# EAGLE design firefly (EAGLE 6.2)
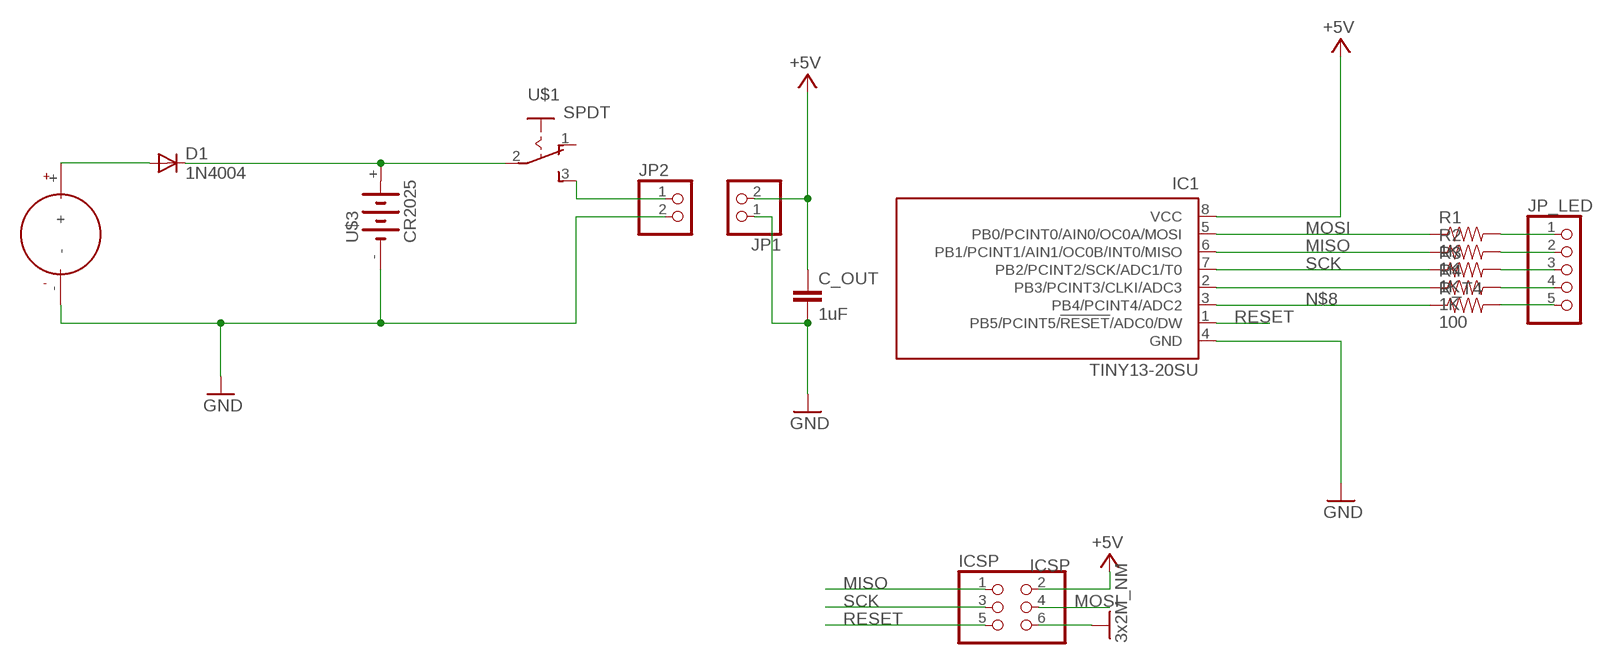
[diagram p0: schematic, sheet 1]

## Parts
C_OUT  1uF  CAP0805  [0805]
D1  1N4004  [DO41-10]
IC1  TINY13-20SU  [8S2]
ICSP  ICSP  PINHD-2X3  [2X03]
JP1  PINHD-1X2  [1X02]
JP2  PINHD-1X2  [1X02]
JP_LED  PINHD-1X5  [1X05]
R1  1K  RESISTOR  [0805]
R2  1K  RESISTOR  [0805]
R3  1K  RESISTOR  [0805]
R4  1K  RESISTOR  [0805]
R_T4  100  RESISTOR  [0805]
U$1  SPDT  [SPDT]
U$3  CR2025  [CR2025]
U$4  PANEL_60_60  [PANEL_60_60]

## Nets
+5V [usbvcc]: C_OUT.1 IC1.8(VCC) ICSP.2 JP1.2
GND: C_OUT.2 IC1.4(GND) ICSP.6 JP1.1 JP2.2 U$3.- U$4.- ; supply symbol labelled 3x2M_NM
MISO: IC1.6(PB1/PCINT1/AIN1/OC0B/INT0/MISO) ICSP.1 R2.1
MOSI: IC1.5(PB0/PCINT0/AIN0/OC0A/MOSI) ICSP.4 R1.1
N$1: JP_LED.1 R1.2
N$2: JP_LED.5 R_T4.2
N$3: D1.A U$4.+
N$4: D1.C U$1.2(P) U$3.+
N$5: JP_LED.2 R2.2
N$6: IC1.2(PB3/PCINT3/CLKI/ADC3) R4.1
N$7: JP_LED.3 R3.2
N$8: IC1.3(PB4/PCINT4/ADC2) R_T4.1
N$9: JP2.1 U$1.3(S)
N$10: JP_LED.4 R4.2
RESET: IC1.1(PB5/PCINT5/!RESET!/ADC0/DW) ICSP.5
SCK: IC1.7(PB2/PCINT2/SCK/ADC1/T0) ICSP.3 R3.1
Unconnected: U$1.1(O)

## Library data of the parts
C_OUT = SparkFun:CAP: Capacitor Standard 0603 ceramic capacitor, and 0.1" leaded capacitor.
D1 = diode:1N4004: DIODE general purpose rectifier, 1 A
IC1 = atmel:TINY13: 8-bit AVR Microcontroller with 1K Bytes In-System Programmable Flash Source: http://www.atmel.com/dyn/resources/prod_documents/2535S.pdf; MPN: ATTINY13-20SU; OC_FARNELL: 9171568; OC_NEWARK: 96K6522
ICSP = SmartPrj:PINHD-2X3: PIN HEADER
JP1 JP2 = pinhead:PINHD-1X2: PIN HEADER
JP_LED = pinhead:PINHD-1X5: PIN HEADER
R1-R4 R_T4 = SparkFun:RESISTOR: Resistor Basic schematic elements and footprints for 0603, 1206, and PTH 1/10th watt (small) resistors.
U$1 = SPDT switch:SPDT: http://ro.farnell.com/jsp/search/productdetail.jsp?SKU=1201431
U$3 = cr2025:CR2025
U$4 = PANEL_60_60:PANEL_60_60

## Net classes
2 gnd: width 0.254 mm, drill 0.61 mm, clearance 0.254 mm
3 usbvcc: width 0.254 mm, drill 0.61 mm, clearance 0.254 mm

## Board
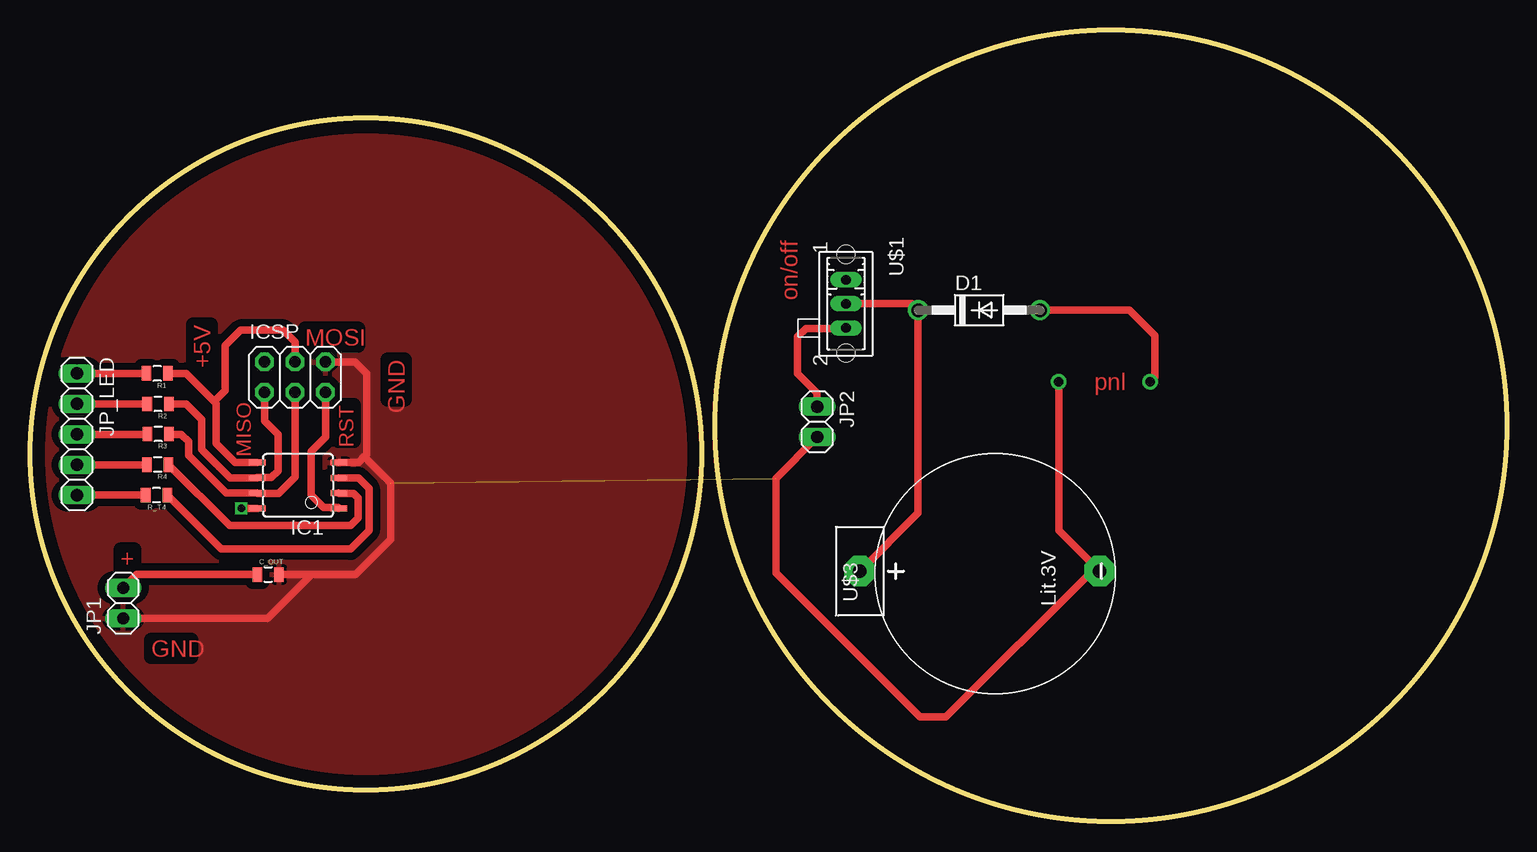
[diagram p1: board, top side]
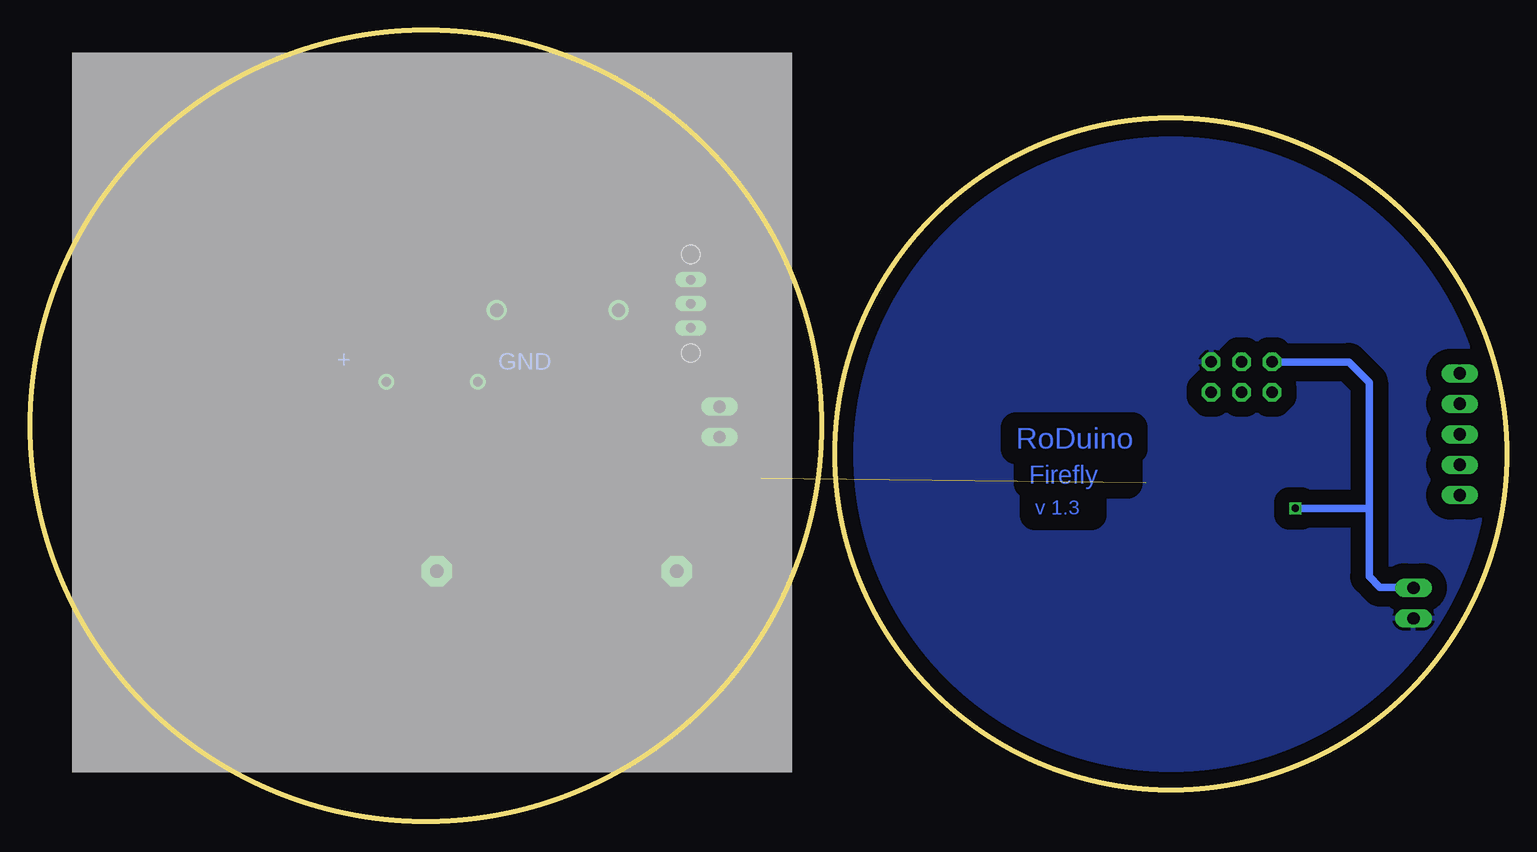
[diagram p2: board, bottom side, seen from below]

Size 123.1 x 66 mm. Coordinates in mm from the lower left corner, seen from the top.
Outline: circle at 28,30.65 radius 28
Outline: circle at 90.1,33 radius 33
Copper layers (1*16): Top 0.035mm / dielectric 1.5mm / Bottom 0.035mm
Design rules: minimum track width 10mil, minimum drill 24mil, track to track 8mil, track to pad 8mil, pad to pad 8mil, via to via 8mil, smd to smd 8mil, copper to edge 40mil, drill to drill 8mil, minimum pad ring 10mil, minimum via ring 8mil, stop-mask expansion 4mil, vias tented up to drill 0mil, thermal gap 10mil

### Footprints (pad centres in the part's own frame; a part is rotated, then mirrored left to right if it is on the bottom)
0805 = smd 0.8 x 1.2: 1 -0.9,0; 2 0.9,0
DO41-10 = drill 1.118: A 5.08,0; C -5.08,0
8S2 = smd 0.5 x 1.4: 1 -1.905,-3.404; 2 -0.645,-3.404; 3 0.625,-3.404; 4 1.895,-3.404; 5 1.905,3.404; 6 0.635,3.404; 7 -0.635,3.404; 8 -1.905,3.404
2X03 = drill 0.95 pad 1.55 octagon: 1 -2.54,-1.27; 2 -2.54,1.27; 3 0,-1.27; 4 0,1.27; 5 2.54,-1.27; 6 2.54,1.27
1X02 = drill 1.016 long: 1 -1.27,0; 2 1.27,0
1X05 = drill 1.016 long: 1 -5.08,0; 2 -2.54,0; 3 0,0; 4 2.54,0; 5 5.08,0
SPDT = drill 0.8 long: 1 -2.007,0; 2 0,0; 3 2.007,0 | hole 1.5: -4.115,0; 4.115,0
CR2025 = drill 1.118 pad 2.54 octagon: + 0,10; - 0,-10
PANEL_60_60 = drill 0.8: + -3.81,2.54; - 3.81,2.54

### Placement (x,y rotation side)
C_OUT  19.86,20.6 0 top
D1  79.12,42.64 0 top
IC1  22.34,28.03 90 top
ICSP  22.09,37.05 0 top
JP1  7.77,18.22 90 top
JP2  65.62,33.32 270 top
JP_LED  3.92,32.29 270 top
R1  10.61,37.36 180 top
R2  10.67,34.81 180 top
R3  10.68,32.31 180 top
R4  10.64,29.76 180 top
R_T4  10.55,27.21 180 top
U$1  68.02,43.17 270 top
U$3  79.17,20.87 90 top
U$4  89.57,34.12 0 bottom

### Tracks (layer width: path | path; a pad name or v marks a point on that pad's centre or on a via)
+5V  (via drill 0.6)
  Top 0.61: C_OUT.1 8.88,20.6 JP1.2 | IC1.8 v17.62,26.12
  Bottom 0.61: ICSP.2 13.17,38.32 11.47,36.62 11.47,25.97 | 11.47,25.97 11.47,20.42 10.57,19.52 7.8,19.52 JP1.2 | v17.62,26.12 11.62,26.12 11.47,25.97
GND  (1 unrouted)
  Top 0.61: IC1.4 27.38,29.93 27.87,30.42 | 27.87,30.42 28.07,30.62 28.07,37.37 27.12,38.32 ICSP.6 | C_OUT.2 23.47,20.6 | 23.47,20.6 27.15,20.6 30.07,23.52 30.07,28.22 27.87,30.42 | 23.47,20.6 19.82,16.95 JP1.1 | JP2.2 62.17,28.6 62.17,20.72 74.17,8.72 76.37,8.72 88.52,20.87 U$3.- 85.76,24.28 U$4.-
  pour Top (isolate 0.61): -0.23,2.32 -0.23,58.07 56.12,57.82 56.12,2.07
  pour Bottom (isolate 1.27): -0.13,57.92 56.07,57.52 56.07,1.67 -0.13,2.07
MISO
  Top 0.61: R2.1 13.02,34.82 14.32,33.52 14.32,31.02 16.68,28.66 IC1.6 20.12,28.67 20.67,29.22 20.67,32.27 19.55,33.39 ICSP.1
MOSI
  Top 0.61: R1.1 13.03,37.36 15.37,35.02 | 15.37,35.02 15.52,34.87 15.52,31.52 17.12,29.92 18.92,29.92 IC1.5 | ICSP.4 22.09,40 21.12,40.97 17.57,40.97 16.27,39.67 16.27,35.92 15.37,35.02
N$1
  Top 0.61: JP_LED.1 R1.2
N$2
  Top 0.61: JP_LED.5 R_T4.2
N$3
  Top 0.61: D1.A 91.65,42.64 93.77,40.52 93.77,37.05 U$4.+
N$4
  Top 0.61: U$1.2 73.51,43.17 D1.C 74.04,25.74 U$3.+
N$5
  Top 0.61: JP_LED.2 9.75,34.83 R2.2
N$6
  Top 0.61: R4.1 16.63,24.67 26.72,24.67 27.37,25.32 27.37,26.97 26.97,27.37 25.76,27.37 IC1.2
N$7
  Top 0.61: JP_LED.3 9.76,32.29 R3.2
N$8
  Top 0.61: IC1.3 27.38,28.66 28.27,27.77 28.27,24.27 26.72,22.72 15.94,22.72 R_T4.1
N$9
  Top 0.61: JP2.1 65.62,35.72 63.97,37.37 63.97,40.42 64.67,41.12 67.98,41.12 U$1.3
N$10
  Top 0.61: JP_LED.4 R4.2
RESET
  Top 0.61: ICSP.5 24.63,32.08 23.42,30.87 23.42,27.22 24.47,26.17 25.7,26.17 IC1.1
SCK
  Top 0.61: R3.1 11.62,32.27 12.62,32.27 13.22,31.67 13.22,30.52 16.34,27.39 IC1.7 18.96,27.37 20.72,27.37 22.09,28.74 ICSP.3

### Text on the board
Top: on/off | +5V | MOSI | GND | pnl | MISO | RST | + | GND
Bottom: + | GND | RoDuino | Firefly | v 1.3
tDocu: GND | RESET | MOSI | SCK | +5V | MISO